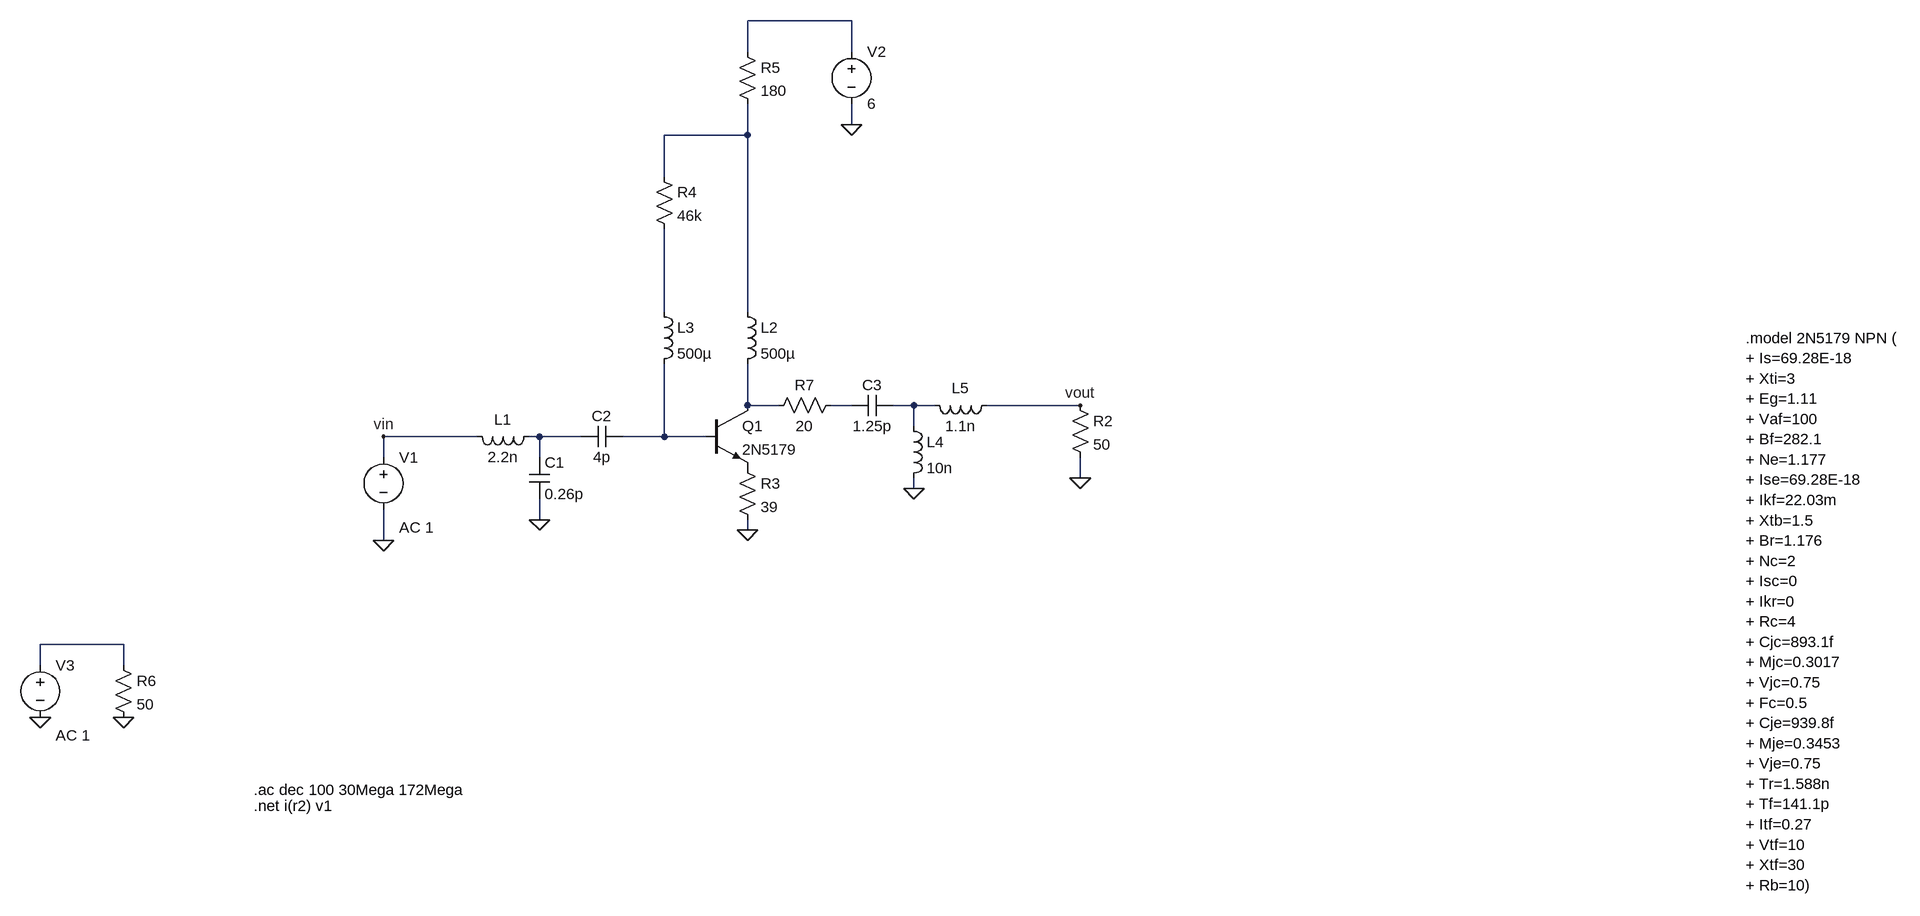
[diagram p0: schematic VHFLNASimulation.asc]
VHFLNASimulation.asc, the LTspice schematic file:
Version 4.1
SHEET 1 1768 936
WIRE -544 -736 -704 -736
WIRE -704 -688 -704 -736
WIRE -544 -688 -544 -736
WIRE -544 -576 -544 -608
WIRE -704 -560 -704 -608
WIRE -704 -560 -832 -560
WIRE -832 -496 -832 -560
WIRE -832 -288 -832 -416
WIRE -704 -288 -704 -560
WIRE -704 -144 -704 -208
WIRE -656 -144 -704 -144
WIRE -544 -144 -576 -144
WIRE -448 -144 -480 -144
WIRE -416 -144 -448 -144
WIRE -192 -144 -336 -144
WIRE -448 -112 -448 -144
WIRE -1120 -96 -1264 -96
WIRE -1024 -96 -1040 -96
WIRE -960 -96 -1024 -96
WIRE -832 -96 -832 -208
WIRE -832 -96 -896 -96
WIRE -768 -96 -832 -96
WIRE -1264 -64 -1264 -96
WIRE -1024 -64 -1024 -96
WIRE -192 -32 -192 -64
WIRE -448 -16 -448 -32
WIRE -1024 32 -1024 0
WIRE -704 48 -704 32
WIRE -1264 64 -1264 16
WIRE -1664 224 -1792 224
WIRE -1792 256 -1792 224
WIRE -1664 256 -1664 224
FLAG -1664 336 0
FLAG -1792 336 0
FLAG -192 -32 0
FLAG -1264 64 0
FLAG -1264 -96 vin
FLAG -192 -144 vout
FLAG -1024 32 0
FLAG -704 48 0
FLAG -544 -576 0
FLAG -448 -16 0
SYMBOL npn -768 -144 R0
SYMATTR InstName Q1
SYMATTR Value 2N5179
SYMBOL voltage -1792 240 R0
WINDOW 123 24 124 Left 2
WINDOW 39 0 0 Left 0
SYMATTR Value2 AC 1
SYMATTR InstName V3
SYMATTR Value ""
SYMBOL res -1680 240 R0
SYMATTR InstName R6
SYMATTR Value 50
SYMBOL res -208 -160 R0
SYMATTR InstName R2
SYMATTR Value 50
SYMBOL voltage -1264 -80 R0
WINDOW 123 24 124 Left 2
WINDOW 39 0 0 Left 0
SYMATTR Value2 AC 1
SYMATTR InstName V1
SYMATTR Value ""
SYMBOL ind -1024 -112 R90
WINDOW 0 5 56 VBottom 2
WINDOW 3 32 56 VTop 2
SYMATTR InstName L1
SYMATTR Value 2.2n
SYMATTR SpiceLine Rser=1m
SYMBOL cap -1040 -64 R0
SYMATTR InstName C1
SYMATTR Value 0.26p
SYMBOL ind -720 -304 R0
SYMATTR InstName L2
SYMATTR Value 500µ
SYMATTR SpiceLine Rser=1m
SYMBOL res -720 -64 R0
SYMATTR InstName R3
SYMATTR Value 39
SYMBOL ind -848 -304 R0
SYMATTR InstName L3
SYMATTR Value 500µ
SYMATTR SpiceLine Rser=1m
SYMBOL res -848 -512 R0
SYMATTR InstName R4
SYMATTR Value 46k
SYMBOL res -720 -704 R0
SYMATTR InstName R5
SYMATTR Value 180
SYMBOL voltage -544 -704 R0
SYMATTR InstName V2
SYMATTR Value 6
SYMBOL res -560 -160 R90
WINDOW 0 0 56 VBottom 2
WINDOW 3 32 56 VTop 2
SYMATTR InstName R7
SYMATTR Value 20
SYMBOL cap -480 -160 R90
WINDOW 0 0 32 VBottom 2
WINDOW 3 32 32 VTop 2
SYMATTR InstName C3
SYMATTR Value 1.25p
SYMBOL ind -464 -128 R0
SYMATTR InstName L4
SYMATTR Value 10n
SYMATTR SpiceLine Rser=1m
SYMBOL ind -320 -160 R90
WINDOW 0 5 56 VBottom 2
WINDOW 3 32 56 VTop 2
SYMATTR InstName L5
SYMATTR Value 1.1n
SYMATTR SpiceLine Rser=1m
SYMBOL cap -896 -112 R90
WINDOW 0 0 32 VBottom 2
WINDOW 3 32 32 VTop 2
SYMATTR InstName C2
SYMATTR Value 4p
TEXT 832 -248 Left 2 !.model 2N5179 NPN (\n+ Is=69.28E-18\n+ Xti=3\n+ Eg=1.11\n+ Vaf=100\n+ Bf=282.1\n+ Ne=1.177\n+ Ise=69.28E-18\n+ Ikf=22.03m\n+ Xtb=1.5\n+ Br=1.176\n+ Nc=2\n+ Isc=0\n+ Ikr=0\n+ Rc=4\n+ Cjc=893.1f\n+ Mjc=0.3017\n+ Vjc=0.75\n+ Fc=0.5\n+ Cje=939.8f\n+ Mje=0.3453\n+ Vje=0.75\n+ Tr=1.588n\n+ Tf=141.1p\n+ Itf=0.27\n+ Vtf=10\n+ Xtf=30\n+ Rb=10)
TEXT -1464 448 Left 2 !.ac dec 100 30Mega 172Mega
TEXT -1464 472 Left 2 !.net i(r2) v1

The netlist it stands for:
* VHFLNASimulation.asc
Q1 N004 N008 P001 0 2N5179
V3 N009 0 AC 1
R6 N009 0 50
R2 vout 0 50
V1 vin 0 AC 1
L1 N007 vin 2.2n Rser=1m
C1 N007 0 0.26p
L2 N002 N004 500µ Rser=1m
R3 P001 0 39
L3 N003 N008 500µ Rser=1m
R4 N002 N003 46k
R5 N001 N002 180
V2 N001 0 6
R7 N005 N004 20
C3 N006 N005 1.25p
L4 N006 0 10n Rser=1m
L5 vout N006 1.1n Rser=1m
C2 N008 N007 4p
.model NPN NPN
.model PNP PNP
.lib standard.bjt
.model 2N5179 NPN (
+ Is=69.28E-18
+ Xti=3
+ Eg=1.11
+ Vaf=100
+ Bf=282.1
+ Ne=1.177
+ Ise=69.28E-18
+ Ikf=22.03m
+ Xtb=1.5
+ Br=1.176
+ Nc=2
+ Isc=0
+ Ikr=0
+ Rc=4
+ Cjc=893.1f
+ Mjc=0.3017
+ Vjc=0.75
+ Fc=0.5
+ Cje=939.8f
+ Mje=0.3453
+ Vje=0.75
+ Tr=1.588n
+ Tf=141.1p
+ Itf=0.27
+ Vtf=10
+ Xtf=30
+ Rb=10)
.ac dec 100 30Mega 172Mega
.net i(r2) v1
.backanno
.end